# EAGLE design Pugsley (EAGLE 7.0.0)
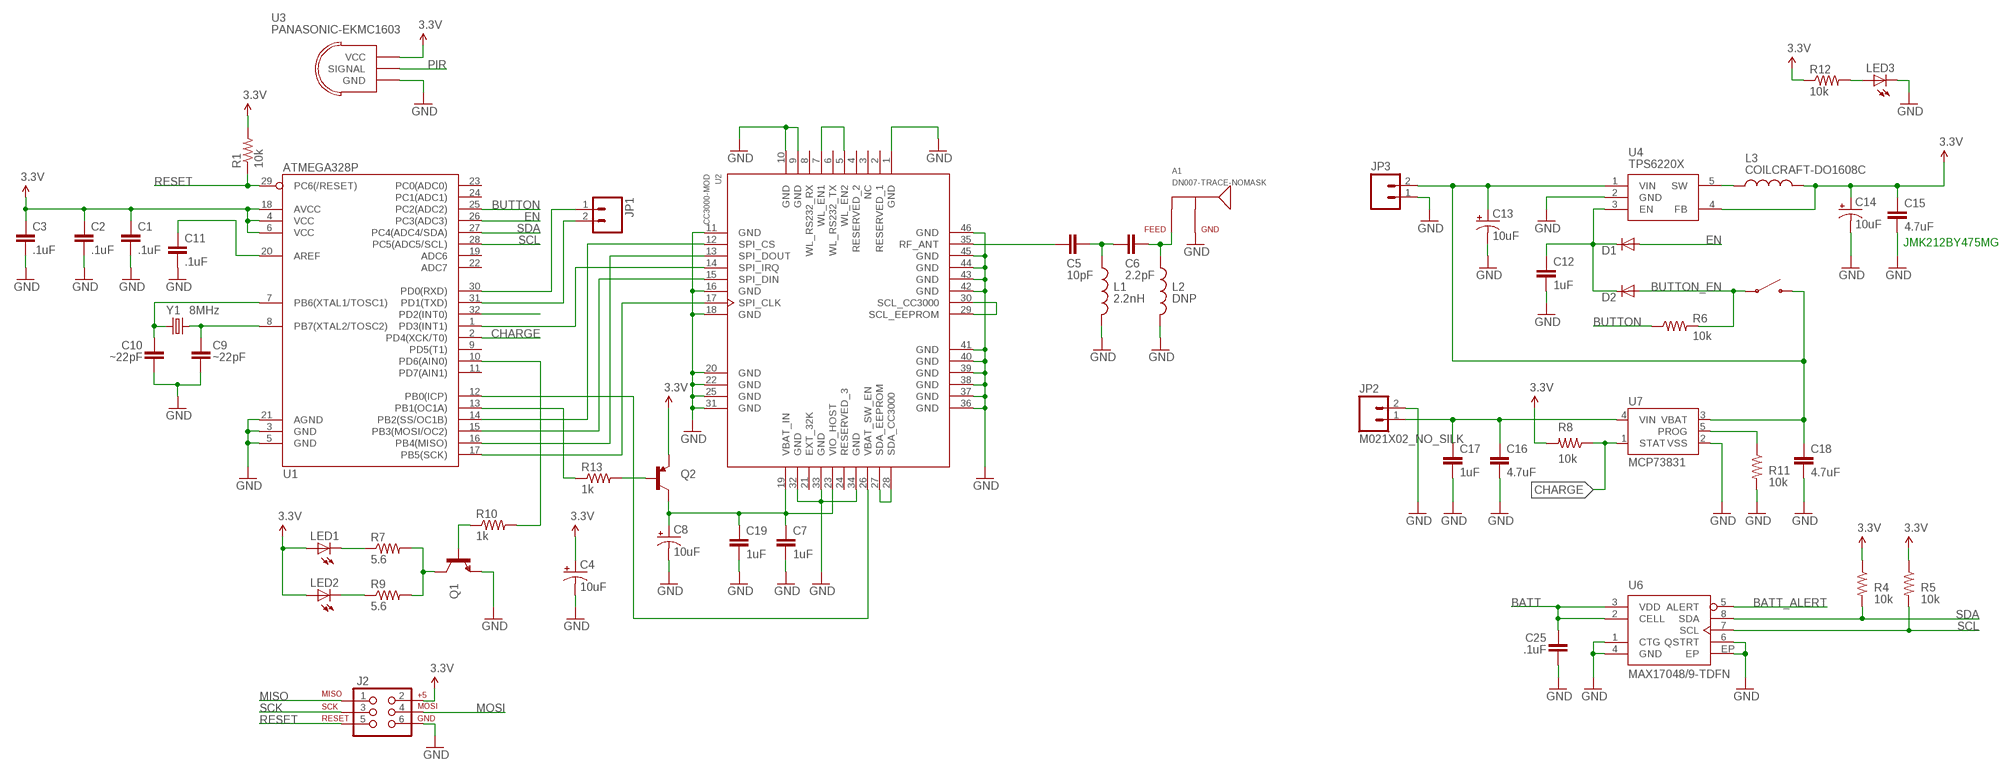
[diagram p0: schematic, sheet 1]

## Parts
A1  DN007-TRACE-NOMASK  [DN007-TRACE-NOMASK]
C1  .1uF  CAP0402-CAP  [0402-CAP]
C2  .1uF  CAP0402-CAP  [0402-CAP]
C3  .1uF  CAP0402-CAP  [0402-CAP]
C4  10uF  CAP_POL1206  [EIA3216]
C5  10pF  CAP0402-CAP  [0402-CAP]
C6  2.2pF  CAP0402-CAP  [0402-CAP]
C7  1uF  CAP0402-CAP  [0402-CAP]
C8  10uF  CAP_POL1206  [EIA3216]
C9  ~22pF  CAP0402-CAP  [0402-CAP]
C10  ~22pF  CAP0402-CAP  [0402-CAP]
C11  .1uF  CAP0402-CAP  [0402-CAP]
C12  1uF  CAP0402-CAP  [0402-CAP]
C13  10uF  CAP_POL1206  [EIA3216]
C14  10uF  CAP_POL1206  [EIA3216]
C15  4.7uF  CAP0805  [0805]
C16  4.7uF  CAP0805  [0805]
C17  1uF  CAP0402-CAP  [0402-CAP]
C18  4.7uF  CAP0805  [0805]
C19  1uF  CAP0402-CAP  [0402-CAP]
C25  .1uF  CAP0402-CAP  [0402-CAP]
D1  DIODESOD  [SOD-323]
D2  DIODESOD  [SOD-323]
J2  AVR_SPI_PRG_6NS  [2X3-NS]
JP1  M021X02_NO_SILK  [1X02_NO_SILK]
JP2  M021X02_NO_SILK  [1X02_NO_SILK]
JP3  M021X02_NO_SILK  [1X02_NO_SILK]
L1  2.2nH  INDUCTOR0402  [C0402]
L2  DNP  INDUCTOR0402  [C0402]
L3  COILCRAFT-DO1608C  [COILCRAFT-DO1608C]
LED1  LED0603  [LED-0603]
LED2  LED0603  [LED-0603]
LED3  LED0603  [LED-0603]
Q1  TRANSISTOR_NPNSOT23  [SOT23]
Q2  TRANSISTOR_PNPSMD  [SOT23-3]
R1  10k  RESISTOR0402-RES  [0402-RES]
R4  10k  RESISTOR0402-RES  [0402-RES]
R5  10k  RESISTOR0402-RES  [0402-RES]
R6  10k  RESISTOR0402-RES  [0402-RES]
R7  5.6  RESISTOR0402-RES  [0402-RES]
R8  10k  RESISTOR0402-RES  [0402-RES]
R9  5.6  RESISTOR0402-RES  [0402-RES]
R10  1k  RESISTOR0402-RES  [0402-RES]
R11  10k  RESISTOR0402-RES  [0402-RES]
R12  10k  RESISTOR0402-RES  [0402-RES]
R13  1k  RESISTOR0402-RES  [0402-RES]
S1  C&K-KSR2XX  [C&K-KSR2XX]
U1  ATMEGA328P  ATMEGA328_SMT  [TQFP32-08]
U2  CC3000-MOD  [CC3000]
U3  PANASONIC-EKMC1603  [PIR-PANASONIC-EKMC1603XXX]
U4  TPS6220X  [SOT23-5]
U6  MAX17048/9-TDFN  [TDFN-8]
U7  MCP73831  [SOT23-5]
Y1  8MHz  CRYSTAL5X3  [CRYSTAL-SMD-5X3]

## Nets
3.3V: C1.1 C2.1 C3.1 C4.A(+) C14.A(+) C15.1 J2.2 L3.2 LED1.A LED2.A Q2.2(E) R1.2 R4.1 R5.1 R8.2 R12.1 U1.4(VCC) U1.6(VCC) U1.18(AVCC) U3.VDD(VCC) U4.4(FB)
BATT: C13.A(+) C18.1 C25.1 JP3.2 S1.P$2 U4.1(VIN) U6.2(CELL) U6.3(VDD) U7.3(VBAT)
BATT_ALERT: U6.5(ALERT)
BUTTON: R6.1 U1.25(PC2(ADC2))
BUTTON_EN: D2.2(A) R6.2 S1.P$1
CHARGE: R8.1 U1.2(PD4(XCK/T0)) U7.1(STAT)
EN: D1.2(A) U1.26(PC3(ADC3))
GND: A1.GND@1(GND) A1.GND@2(GND) C1.2 C2.2 C3.2 C4.C(-) C7.2 C8.C(-) C9.2 C10.2 C11.2 C12.2 C13.C(-) C14.C(-) C15.2 C16.2 C17.2 C18.2 C19.2 C25.2 J2.6 JP2.2 JP3.1 L1.2 L2.2 LED3.C Q1.2(E) R11.2 U1.3(GND) U1.5(GND) U1.21(AGND) U2.1(GND) U2.9(GND) U2.10(GND) U2.11(GND) U2.16(GND) U2.18(GND) U2.20(GND) U2.22(GND) U2.25(GND) U2.31(GND) U2.32(GND) U2.33(GND) U2.34(GND) U2.36(GND) U2.37(GND) U2.38(GND) U2.39(GND) U2.40(GND) U2.41(GND) U2.42(GND) U2.43(GND) U2.44(GND) U2.45(GND) U2.46(GND) U3.GND U4.2(GND) U6.1(CTG) U6.4(GND) U6.6(QSTRT) U6.EP U7.2(VSS)
LED: R10.2 U1.10(PD6(AIN0))
MISO: J2.1 U1.16(PB4(MISO)) U2.13(SPI_DOUT)
MOSI: J2.4 U1.15(PB3(MOSI/OC2)) U2.15(SPI_DIN)
N$1: C11.1 U1.20(AREF)
N$2: C5.2 U2.35(RF_ANT)
N$3: Q1.1(B) R10.1
N$4: C12.1 D1.1(C) D2.1(C) U4.3(EN)
N$5: L3.1 U4.5(SW)
N$6: U1.1(PD3(INT1)) U2.14(SPI_IRQ)
N$7: R11.1 U7.5(PROG)
N$8: U2.29(SCL_EEPROM) U2.30(SCL_CC3000)
N$10: C5.1 C6.2 L1.1
N$11: A1.FEED C6.1 L2.1
N$13: U2.27(SDA_EEPROM) U2.28(SDA_CC3000)
N$15: LED1.C R7.1
N$16: C9.1 U1.8(PB7(XTAL2/TOSC2)) Y1.3
N$17: U2.5(WL_EN2) U2.7(WL_EN1)
N$20: C10.1 U1.7(PB6(XTAL1/TOSC1)) Y1.1
N$21: C7.1 C8.A(+) C19.1 Q2.3(C) U2.19(VBAT_IN) U2.23(VIO_HOST)
N$23: Q1.3(C) R7.2 R9.2
N$24: LED2.C R9.1
N$25: LED3.A R12.2
N$26: Q2.1(B) R13.2
PIR: U1.32(PD2(INT0)) U3.OUT(SIGNAL)
RESET: J2.5 R1.1 U1.29(PC6(/RESET))
RX: JP1.1 U1.30(PD0(RXD))
SCK: J2.3 U1.17(PB5(SCK)) U2.17(SPI_CLK)
SCL: R5.2 U1.28(PC5(ADC5/SCL)) U6.7(SCL)
SDA: R4.2 U1.27(PC4(ADC4/SDA)) U6.8(SDA)
TX: JP1.2 U1.31(PD1(TXD))
VIN: C16.1 C17.1 JP2.1 U7.4(VIN)
WIFI_CS: U1.14(PB2(SS/OC1B)) U2.12(SPI_CS)
WIFI_EN: U1.12(PB0(ICP)) U2.26(VBAT_SW_EN)
WIFI_PWR: R13.1 U1.13(PB1(OC1A))
Unconnected: U1.9(PD5(T1)) U1.11(PD7(AIN1)) U1.19(ADC6) U1.22(ADC7) U1.23(PC0(ADC0)) U1.24(PC1(ADC1)) U2.2(RESERVED_1) U2.3(NC) U2.4(RESERVED_2) U2.6(WL_RS232_TX) U2.8(WL_RS232_RX) U2.21(EXT_32K) U2.24(RESERVED_3)

## Notes on the sheet
- JMK212BY475MG

## Library data of the parts
A1 = Supernode-Antennas:DN007-TRACE
C1-C3 C5-C7 C9-C12 C15-C19 C25 = SparkFun-Capacitors:CAP: Capacitor Standard 0603 ceramic capacitor, and 0.1" leaded capacitor.
C4 C8 C13 C14 = SparkFun-Capacitors:CAP_POL: Capacitor Polarized These are standard SMD and PTH capacitors. Normally 10uF, 47uF, and 100uF in electrolytic and tantalum varieties. Always verify the external diameter of the through hole cap, it varies with capacity, voltage, and manufacturer. The EIA devices should be standard.
D1 D2 = SparkFun-DiscreteSemi:DIODE: Diode These are standard reverse protection diodes and small signal diodes. SMA package can handle up to about 1A. SOD-323 can handle about 200mA. What the SOD-323 package when ordering, there are some mfgs out there that are 5-pin packages.; PROD_ID: DIO-09646
J2 = SparkFun-Connectors:AVR_SPI_PRG_6: AVR ISP 6 Pin This is the reduced ISP connector for AVR programming. Common on Arduino. This footprint will take up less PCB space and can be used with a 10-pin to 6-pin adapter such as SKU: BOB-08508
JP1-JP3 = SparkFun-Connectors:M02: Standard 2-pin 0.1" header. Use with - straight break away headers ( PRT-00116) - right angle break away headers (PRT-00553) - swiss pins (PRT-00743) - machine pins (PRT-00117) - female headers (PRT-00115) Molex polarized connector foot print use with: PRT-08233 with associated crimp pins and housings. 2.54_SCREWTERM for use with PRT-10571. 3.5mm Screw Terminal footprints for PRT-08084 5mm Screw Terminal footprints for use with PRT-08433
L1 L2 = SparkFun-Passives:INDUCTOR: Inductors Basic Inductor/Choke - 0603 and 1206. Footprints are not proven and vary greatly between part numbers. SRN6045- 33uH, 20% 1.4A SDR0403-560KL - 56uH, 10%, 500mA RMS/740mA peak
L3 = Supernode-Inductors:COILCRAFT-DO1608C
LED1-LED3 = SparkFun-LED:LED: LEDs Standard schematic elements and footprints for 5mm, 3mm, 1206, and 0603 sized LEDs. 5mm - Spark Fun Electronics SKU : COM-00529 (and others)
Q1 = SparkFun-DiscreteSemi:TRANSISTOR_NPN: Generic NPN BJT MMBT2222A - TRANS-08049 (SOT-23, 1A 40V) MPSA42 - TRANS-09116 (SOT-23, 500mA 300V) MMBT5088LT1G - TRANS-11160 (SOT-23, 50 mA 30V)
Q2 = SparkFun-DiscreteSemi:TRANSISTOR_PNP: Generic PNP BJT Double check pinouts against datasheets- not all devices are the same! MMBT3906 - 40V 200mA SOT-23 (TRANS-08052) MMBT4403 - 40V 600mA SOT-23 (TRANS-09245)
R1 R4-R13 = SparkFun-Passives:RESISTOR: Resistor Basic schematic elements and footprints for 0603, 1206, and PTH resistors.
S1 = Supernode-Electromechanical:C&K-KSR2XX
U1 = SparkFun-DigitalIC:ATMEGA328_SMT: 32-Pin Atmega328 part Commonly used on Arduino compatible boards Available in QFP and QFN packages TQFP is IC-09069 QFN is non-stock; PROD_ID: IC-09069
U2 = Supernode-RF:CC3000-MOD
U3 = Supernode-Sensors:PANASONIC-EKMC16
U4 = Supernode-PowerIC:TPS6220X: Texas Instruments TPS6220X Adjustable, 300-mA, 95% Efficient Step-Down Converter in SOT-23 Description The TPS6220x devices are a family of high-efficiency synchronous step-down converters ideally suited for portable systems powered by 1-cell Li-Ion or 3-cell NiMH/NiCd batteries. The devices are also suitable to operate from a standard 3.3-V or 5-V voltage rail. With an output voltage range of 6 V down to 0.7 V and up to 300 mA output current, the devices are ideal to power low voltage DSPs and processors used in PDAs, pocket PCs, and smart phones. Under nominal load current, the devices operate with a fixed switching frequency of typically 1 MHz. At light load currents, the part enters the power save mode operation; the switching frequency is reduced and the quiescent current is typically only 15 µA; therefore, it achieves the highest efficiency over the entire load current range. The TPS6220x needs only three small external components. Together with the SOT23 package, a minimum system solution size is achieved. An advanced fast response voltage mode control scheme achieves superior line and load regulation with small ceramic input and output capacitors. Features High Efficiency Synchronous Step-Down Converter With up to 95% Efficiency 2.5-V to 6-V Input Voltage Range Adjustable Output Voltage Range From 0.7 V to VI Fixed Output Voltage Options Available Up to 300 mA Output Current 1-MHz Fixed Frequency PWM Operation Highest Efficiency Over Wide Load Current Range Due to Power Save Mode 15-µA Typical Quiescent Current Soft Start 100% Duty Cycle Low-Dropout Operation Dynamic Output-Voltage Positioning Available in a 5-Pin SOT23 Package APPLICATIONS PDAs and Pocket PC Cellular Phones, Smart Phones Low Power DSP Supply Digital Cameras Portable Media Players Portable Equipment
U6 = Supernode-PowerIC:MAX17048/9
U7 = SparkFun-PowerIC:MCP73831: Miniature single cell, fully integrated Li-Ion, Li-polymer charge management controller http://ww1.microchip.com/downloads/en/DeviceDoc/21984a.pdf IC-09995; PROD_ID: IC-09995
Y1 = SparkFun-FreqCtrl:CRYSTAL: Various standard crystals. Proven footprints. Spark Fun Electronics SKU : COM-00534

## Board
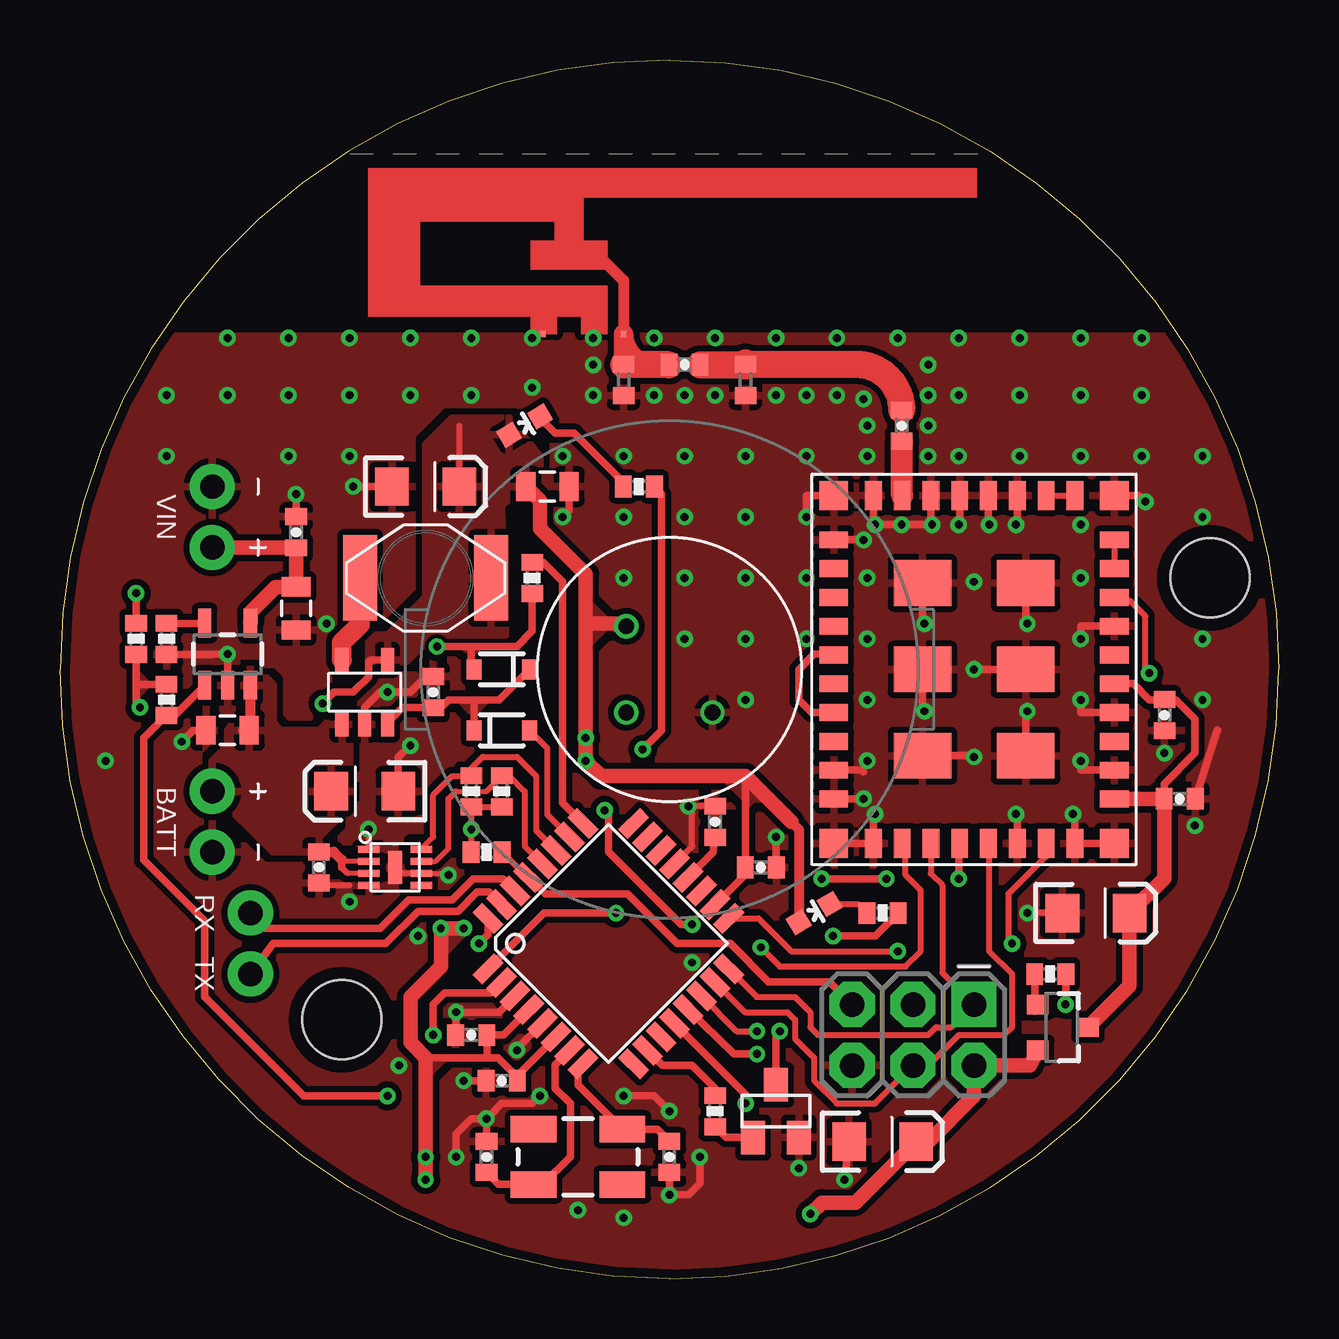
[diagram p1: board, top side]
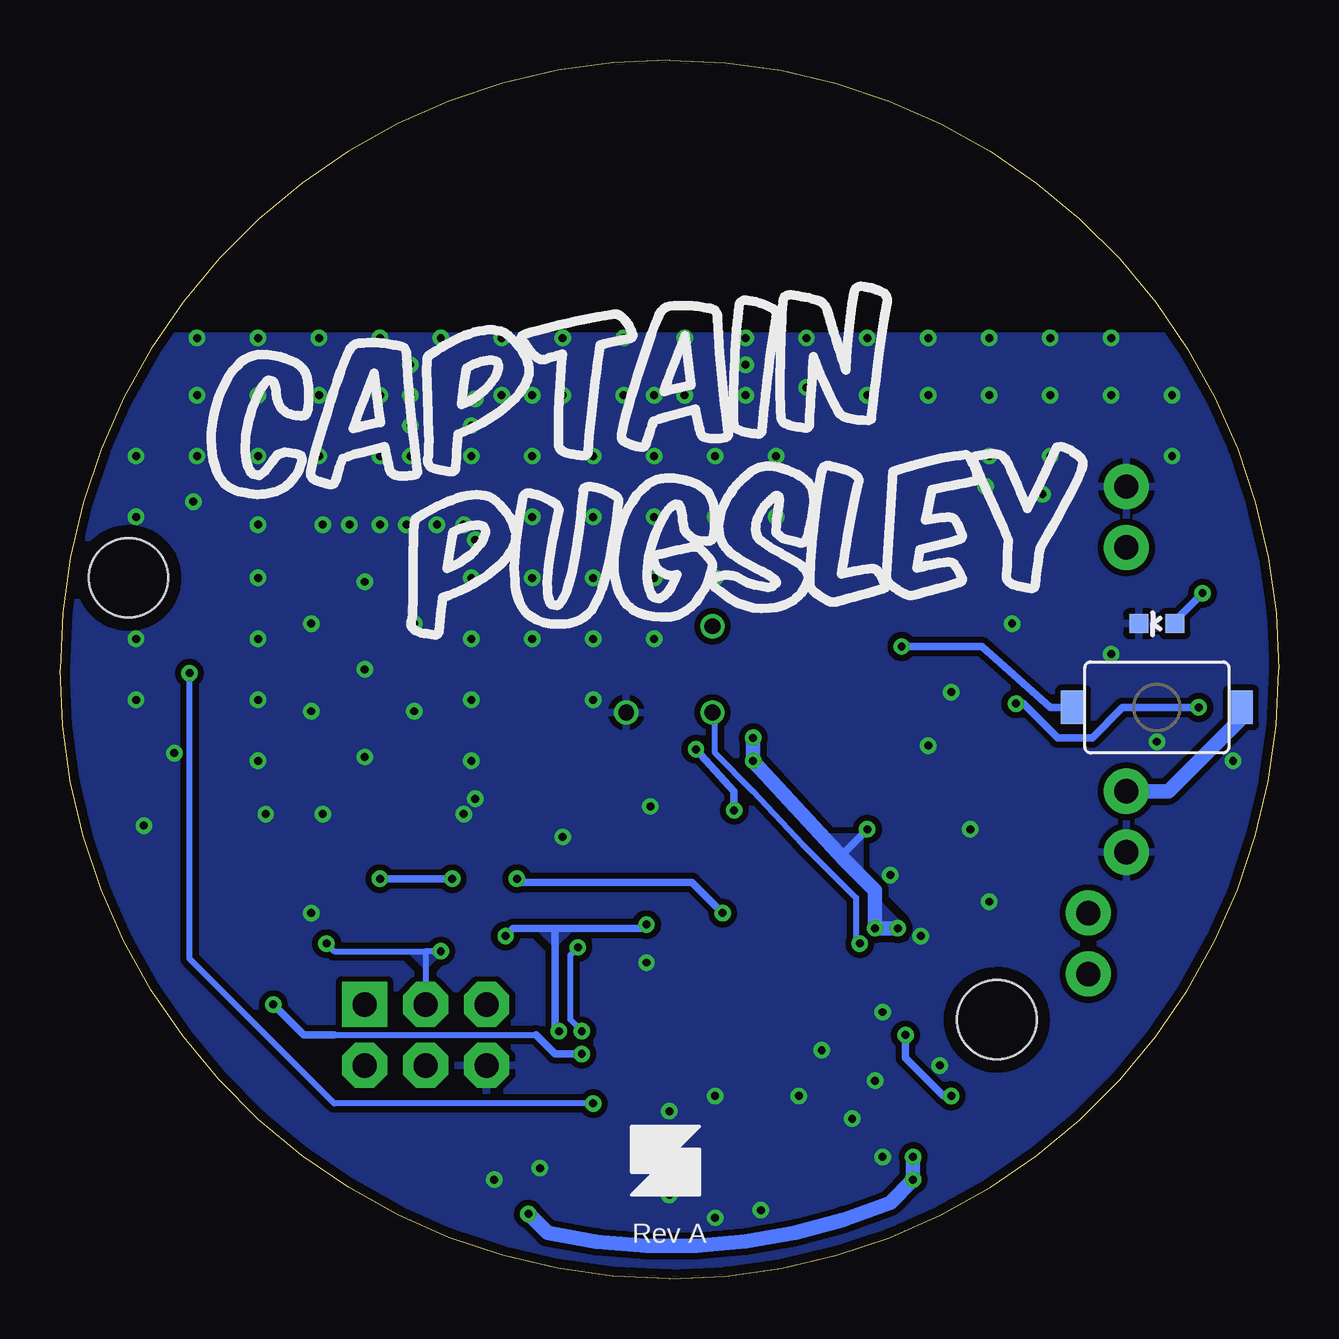
[diagram p2: board, bottom side, seen from below]

Size 50.8 x 50.8 mm. Coordinates in mm from the lower left corner, seen from the top.
Outline: 25.4,0 arc-90 0,25.4 arc-90 25.4,50.8 arc-90 50.8,25.4 arc-90 25.4,0
Copper layers (1*16): Top 0.0356mm / dielectric 1.5011mm / Bottom 0.0356mm
Design rules "OSHPark *": minimum track width 6mil, minimum drill 13mil, track to track 6mil, track to pad 6mil, pad to pad 6mil, via to via 6mil, smd to smd 6mil, copper to edge 15mil, drill to drill 6mil, minimum pad ring 7mil, minimum via ring 7mil, stop-mask expansion 4mil, vias tented up to drill 13mil, thermal gap 10mil
tRestrict: 2 lines

### Footprints (pad centres in the part's own frame; a part is rotated, then mirrored left to right if it is on the bottom)
DN007-TRACE-NOMASK = smd 0.25 x 0.25: FEED 0,0; GND@1 -3.38,0; GND@2 -1.27,0
0402-CAP = smd 0.7 x 0.9: 1 -0.65,0; 2 0.65,0
EIA3216 = smd 1.4 x 1.6: A 1.4,0; C -1.4,0
0805 = smd 0.8 x 1.2: 1 -0.9,0; 2 0.9,0
SOD-323 = smd 0.63 x 0.83: 1 -1.15,0; 2 1.15,0
2X3-NS = drill 1.016 pad 1.88 square: 1 -2.54,-1.27 | drill 1.016 pad 1.88 octagon: 2 -2.54,1.27; 3 0,-1.27; 4 0,1.27; 5 2.54,-1.27; 6 2.54,1.27
1X02_NO_SILK = drill 1.016 pad 1.88: 1 0,0; 2 2.54,0
C0402 = smd 0.7 x 0.9: 1 -0.65,0; 2 0.65,0
COILCRAFT-DO1608C = smd 1.4 x 3.56: 1 -2.73,0; 2 2.73,0
LED-0603 = smd 0.8 x 0.8: A 0,-0.75; C 0,0.75
SOT23 = smd 1 x 1.4: 1 -0.95,-1.1; 2 0.95,-1.1; 3 0,1.1
SOT23-3 = smd 0.8 x 0.9: 1 -0.95,-1; 2 0.95,-1; 3 0,1.1
0402-RES = smd 0.7 x 0.9: 1 -0.65,0; 2 0.65,0
C&K-KSR2XX = smd 1 x 1.4: P$1 -3.5,0; P$2 3.5,0
TQFP32-08 = smd 1.27 x 0.559: 1 -4.293,2.8; 2 -4.293,2; 3 -4.293,1.2; 4 -4.293,0.4; 5 -4.293,-0.4; 6 -4.293,-1.2; 7 -4.293,-2; 8 -4.293,-2.8; 17 4.293,-2.8; 18 4.293,-2; 19 4.293,-1.2; 20 4.293,-0.4; 21 4.293,0.4; 22 4.293,1.2; 23 4.293,2; 24 4.293,2.8 | smd 0.559 x 1.27: 9 -2.8,-4.293; 10 -2,-4.293; 11 -1.2,-4.293; 12 -0.4,-4.293; 13 0.4,-4.293; 14 1.2,-4.293; 15 2,-4.293; 16 2.8,-4.293; 25 2.8,4.293; 26 2,4.293; 27 1.2,4.293; 28 0.4,4.293; 29 -0.4,4.293; 30 -1.2,4.293; 31 -2,4.293; 32 -2.8,4.293
CC3000 = smd 1.2 x 0.7: 1 -5.85,5.4; 2 -5.85,4.2; 3 -5.85,3; 4 -5.85,1.8; 5 -5.85,0.6; 6 -5.85,-0.6; 7 -5.85,-1.8; 8 -5.85,-3; 9 -5.85,-4.2; 10 -5.85,-5.4; 19 5.85,-5.4; 20 5.85,-4.2; 21 5.85,-3; 22 5.85,-1.8; 23 5.85,-0.6; 24 5.85,0.6; 25 5.85,1.8; 26 5.85,3; 27 5.85,4.2; 28 5.85,5.4 | smd 0.7 x 1.2: 11 -4.2,-7.25; 12 -3,-7.25; 13 -1.8,-7.25; 14 -0.6,-7.25; 15 0.6,-7.25; 16 1.8,-7.25; 17 3,-7.25; 18 4.2,-7.25; 29 4.2,7.25; 30 3,7.25; 31 1.8,7.25; 32 0.6,7.25; 33 -0.6,7.25; 34 -1.8,7.25; 35 -3,7.25; 36 -4.2,7.25 | smd 2.4 x 1.9: 37 -2.15,3.6; 38 -2.15,0; 39 -2.15,-3.6; 40 2.15,3.6; 41 2.15,0; 42 2.15,-3.6 | smd 1.2 x 1.2: 43 -5.85,7.25; 44 -5.85,-7.25; 45 5.85,-7.25; 46 5.85,7.25
PIR-PANASONIC-EKMC1603XXX = drill 0.65: GND -1.796,1.796; OUT 1.796,1.796; VDD 1.796,-1.796
SOT23-5 = smd 0.55 x 1: 1 -0.95,-1.35; 2 0,-1.35; 3 0.95,-1.35; 4 0.95,1.35; 5 -0.95,1.35
TDFN-8 = smd 0.9 x 0.3: 1 -1.09,0.75; 2 -1.09,0.25; 3 -1.09,-0.25; 4 -1.09,-0.75; 5 1.09,-0.75; 6 1.09,-0.25; 7 1.09,0.25; 8 1.09,0.75 | smd 0.6 x 1.38: EP 0,0
SOT23-5' = smd 0.55 x 1.2: 1 -0.95,-1.3; 2 0,-1.3; 3 0.95,-1.3; 4 0.95,1.3; 5 -0.95,1.3
STAND-OFF = hole 3.302: 0,0
CRYSTAL-SMD-5X3 = smd 1.9 x 1.1: 1 -1.85,-1.15; 2 1.85,-1.15; 3 1.85,1.15; 4 -1.85,1.15

### Placement (x,y rotation side)
A1  23.5,39.37 0 top
C1  17.14,10.16 180 top
C2  29.21,17.14 0 top
C3  18.41,8.26 180 top
C4  34.29,5.71 0 top
C5  35.08,35.56 270 top
C6  26.04,38.1 0 top
C7  46.67,20 0 top
C8  43.18,15.24 0 top
C9  25.4,5.08 270 top
C10  17.78,5.08 90 top
C11  27.3,19.05 90 top
C12  15.56,24.45 90 top
C13  12.7,20.32 180 top
C14  15.24,33.02 0 top
C15  20.32,33.02 0 top
C16  9.84,27.94 270 top
C17  9.84,31.11 90 top
C18  6.99,22.86 180 top
C19  46.04,23.5 270 top
C25  10.79,17.14 270 top
D1  18.41,22.86 0 top
D2  18.41,25.4 180 top
J2  35.56,10.16 180 top
JP1  7.94,15.24 270 top
JP2  6.35,30.48 90 top
JP3  6.35,17.78 90 bottom
L1  28.57,37.47 270 top
L2  23.5,37.47 270 top
L3  15.24,29.21 0 top
LED1  19.37,35.56 300.7 top
LED2  31.43,15.24 300.7 top
LED3  5.08,27.3 90 bottom
Q1  29.84,6.99 0 top
Q2  41.75,10.48 270 top
R1  17.78,17.78 180 top
R4  17.14,20.32 90 top
R5  18.41,20.32 90 top
R6  19.68,29.21 270 top
R7  24.13,33.02 0 top
R8  4.45,24.13 90 top
R9  34.29,15.24 0 top
R10  27.3,6.99 90 top
R11  4.45,26.67 270 top
R12  3.17,26.67 90 top
R13  41.27,12.7 180 top
S1  5.08,23.81 0 bottom
U1  22.86,13.97 45 top
U2  38.1,25.4 0 top
U3  25.4,25.4 180 top
U4  12.7,24.45 0 top
U6  13.97,17.14 0 top
U7  MCP73831  [SOT23-5']  6.99,26.04 0 top
U$1  [STAND-OFF]  11.75,10.79 0 top
U$2  [STAND-OFF]  47.94,29.21 0 top
Y1  21.59,5.08 0 top

### Tracks (layer width: path | path; a pad name or v marks a point on that pad's centre or on a via)
3.3V  (via drill 0.33)
  Top 0.254: R5.1 R4.1 v17.14,18.73 17.14,17.8 R1.2 | 16.64,35.56 C14.A
  Top 0.305: U1.4 18.48,10.16 C1.1 17.8,9.22 17.78,9.21 | U1.6 19.07,8.48 | 19.07,8.48 C3.1 | 17.78,9.21 18.26,9.21 18.91,8.56 19.07,8.48 | 17.78,9.21 15.24,9.21 | U1.18 28.56,16.84 C2.1 28.73,17.32 28.57,17.32 28.57,20.95 | v3.33,23.81 3.17,23.97 3.17,24.77 | 3.17,24.77 R12.1 | R8.2 4.43,24.77 3.17,24.77 | U4.4 12.94,25.8 12.86,25.72 12.86,25.08 12.22,24.45 11.43,24.45 v10.95,23.97
  Top 0.406: LED2.A 30.8,18.73 30.48,19.05
  Top 0.61: v16.83,14.61 v15.88,14.61 15.88,13.02 14.61,11.75 14.61,9.84 15.24,9.21 v15.24,5.08 v15.24,4.13 | 19.68,32.76 C15.1 20,32.44 20,31.27 21.91,29.37 21.91,27.3 | v31.27,2.7 31.75,3.17 33.15,3.17 C4.A 36.2,5.71 38.1,7.62 J2.2 40.43,8.89 Q2.2 | 30.48,19.05 28.57,20.95 22.54,20.95 v21.91,21.59 v21.91,22.54 21.91,27.3 | 21.91,27.3 23.18,27.3 23.29,27.2 U3.VDD
  Bottom 0.254: 18.34,17.54 18.18,17.54 18.1,17.46
  Bottom 0.305: v3.33,23.81 6.51,23.81 7.78,22.54 9.21,22.54 10.64,23.97 v10.95,23.97 | v17.14,18.73 18.34,17.54
  Bottom 0.61: v21.91,22.54 v21.91,21.59 18.1,17.46 16.83,16.19 v16.83,14.61 v15.88,14.61 | v31.27,2.7 30.48,1.91 arc-35 16.19,3.17 v15.24,4.13 v15.24,5.08
  pour Top: 14.45,25.72 15.56,26.83 18.57,26.83 18.41,32.23 20,33.66 20,34.29 18.73,35.88 16.35,35.88 15.24,34.77 15.24,28.42 13.65,26.83 13.18,26.83 12.86,26.51 12.86,25.72
  pour Top: 16.03,9.21 15.24,9.21 15.24,8.41
  pour Bottom: 17.46,18.41 17.46,16.83 19.05,18.41
  pour Top: 3.65,24.77 3.17,24.29 3.17,25.24
  pour Bottom: 15.88,14.61 16.83,14.61 16.83,15.56
  pour Top: 15.88,14.61 16.83,14.61 15.88,13.65
  pour Top: 27.62,20.95 28.57,20 28.57,19.68 28.89,20 29.53,20 28.57,20.95
  pour Top: 22.7,27.3 21.91,28.1 21.91,26.51
BATT
  Top 0.203: U6.3 12,16.89 | U6.2 11.81,17.39
  Top 0.254: 12,16.89 11.75,17.14 | 11.81,17.39 11.75,17.46
  Top 0.305: 11.75,17.14 11.75,17.46
  Top 0.406: C25.1 11.41,17.8 11.75,17.46 | U7.3 7.93,23.18 7.62,22.86
  Bottom 0.61: JP3.2 4.6,20.32 1.59,23.34 S1.P$2
  pour Top (isolate 0.254): 6.35,21.59 6.99,22.23 6.99,22.86 7.46,23.5 7.46,25.4 8.26,25.4 8.89,24.77 8.89,23.18 9.21,22.86 10.79,22.86 11.43,23.5 11.75,23.5 12.06,23.18 12.06,19.68 10.79,18.41 10.79,17.78 8.89,17.78 6.35,20.32
BUTTON
  Top 0.305: U1.25 20.95,19.84 20.95,29.05 20.15,29.86 R6.1
BUTTON_EN  (via drill 0.33)
  Top 0.305: 17.14,25.52 D2.2 17.14,25.4 17.14,26.35 | v15.72,26.35 17.14,26.35 | 17.14,26.35 19.05,26.35 19.68,26.99 R6.2
  Bottom 0.305: S1.P$1 9.53,23.81 12.38,26.35 v15.72,26.35
  pour Top: 17.14,26.04 16.83,26.35 17.46,26.35
CHARGE  (via drill 0.33)
  Top 0.305: U1.2 17.97,11.91 16.03,11.91 15.56,11.43 v15.56,10.16 | v13.65,7.62 10.16,7.62 6.03,11.75 6.03,14.92 3.49,17.46 3.49,22.54 4.45,23.5 R8.1 4.78,23.48 U7.1
  Bottom 0.305: v15.56,10.16 15.56,9.21 13.97,7.62 v13.65,7.62
EN
  Top 0.254: U1.26 20.32,19.34 20.32,22.11 D1.2
GND  (via drill 0.33)
  Top 0.203: U6.6 16.12,16.89
  Top 0.254: C8.C v40.32,15.24 | 12.06,16.39 10.89,16.39 C25.2 | 16.12,16.89 v16.19,16.83 | U6.6 14.22,16.89 U6.EP | U6.1 12.88,18.55 v12.86,18.73 | C11.2 26.68,19.7 v26.19,19.68 26.35,19.37 26.35,18.03 U1.21
  Top 0.305: C17.2 v9.84,32.7 | U7.2 v6.99,26.04 6.33,26.02 R11.2 | U4.2 12.7,23.81 13.34,24.45 v13.65,24.45 14.61,24.45 15.26,25.1 C12.2 | C7.2 48.24,22.88 48.26,22.86 | C2.2 29.84,17.14 v29.84,18.41 | C13.C 14.1,21.72 v14.61,22.23 | C14.C v12.22,33.02 | C15.2 21.22,32.02 v20.95,31.75 | C11.2 27,19.7 | U2.9 33.41,21.2 33.5,21.11 | U2.10 v33.49,20 v33.5,20 | v33.97,19.37 33.9,19.3 U2.11 U2.44 | U2.16 39.9,19.31 v39.85,19.37 | v42.23,19.37 42.3,19.3 U2.18 U2.45 | U2.39 38.05,21.8 v38.1,21.75 | U2.42 40.25,23.58 v40.32,23.65 | U2.41 v38.1,25.4 | U2.38 35.95,23.74 v36.04,23.65 | U2.37 35.95,27.39 v36.04,27.3 | U2.40 40.25,27.38 v40.32,27.3 | U2.31 39.9,31.49 v39.85,31.43 | U2.32 38.7,31.47 v38.73,31.43 | U2.33 37.5,31.47 v37.47,31.43 | U2.34 36.3,31.49 v36.35,31.43 v35.08,31.43 v33.97,31.43 33.9,31.5 U2.36 | U2.1 v33.49,30.8 v33.5,30.8 | 32.02,32.65 U2.43 31.11,32.65 v31.11,31.75 | U2.46 44.98,32.65 v45.24,32.38 | U1.5 19.05,9.59 v19.05,9.53 | U1.3 18.3,11.11 v16.51,11.11 | 16.67,11.27 v16.51,11.11 | C3.2 v16.83,8.26 | C10.2 v17.78,6.67 17.14,6.67 16.51,6.03 v16.51,5.08 | C9.2 v25.4,3.49 26.19,3.49 26.67,3.97 v26.67,5.08 | v23.5,7.62 24.77,7.62 v25.4,6.99 | v20,7.62 19.68,7.3 18.41,7.3 17.94,6.83 | C18.2 5.56,22.86 v5.08,22.38 | v16.51,11.11 16.51,10.48 | U2.20 42.55,21.2 v42.55,21.59 | U2.22 42.55,23.6 v42.55,24.13 | U2.25 42.55,27.2 v42.55,26.67 | C4.C v32.7,4.13
  other vias: 12.06,15.72 11.11,27.3 33.66,34.29 33.66,35.56 32.38,36.83 29.84,36.83 27.3,36.83 24.77,36.83 22.23,36.83 19.68,37.15 17.14,36.83 14.61,36.83 33.5,36.67 37.47,36.83 40.01,36.83 42.55,36.83 37.47,34.29 40.01,34.29 31.11,34.29 28.57,34.29 26.04,34.29 23.5,34.29 20.95,34.29 28.57,31.75 26.04,31.75 23.5,31.75 23.5,29.21 26.04,29.21 28.57,29.21 28.57,26.67 26.04,26.67 24.77,39.21 27.3,39.21 29.84,39.21 32.38,39.21 34.92,39.21 37.47,39.21 40.01,39.21 42.55,39.21 36.2,34.29 22.23,38.1 17.14,39.21 14.61,39.21 12.06,39.21 9.53,39.21 38.1,29.05 31.11,29.21 31.11,26.67 23.5,2.54 21.59,2.86 22.23,39.21 19.68,39.21 12.06,36.83 9.53,36.83 6.99,36.83 45.09,36.83 45.09,34.29 31.11,36.83 36.2,35.56 36.2,36.83 36.2,38.1 26.04,36.83 9.53,34.29 12.06,34.29 33.66,26.67 33.66,29.21 33.66,24.13 33.66,21.59 42.55,29.21 45.09,39.21 47.62,34.29 6.99,39.21 4.45,36.83 4.45,34.29 1.91,21.59 14.92,14.29 47.62,31.75 47.31,18.89 26.35,13.18 30.8,4.6 46.04,21.91 42.55,34.29 42.55,31.43 28.57,24.13 47.62,26.67 47.62,24.13 14.13,8.89
  pour Bottom (isolate 0.254, rank 3): 0,0 0,39.29 50.8,39.29 50.8,0
  pour Top (isolate 0.254, rank 3): 0,0 0,39.29 50.8,39.29 50.8,0
LED
  Top 0.305: R10.2 27.3,7.94 26.35,8.89 25.11,8.89 U1.10
MISO
  Top 0.254: U1.16 29.04,11.75 30.64,11.75 31.27,11.11 31.27,10.48 31.59,10.16 36.2,10.16 36.51,10.48 37.15,10.48 J2.1 36.78,12.75 36.78,16.41 36.3,16.88 U2.13
MOSI
  Top 0.254: U1.15 28.55,11.11 30.32,11.11 30.64,10.79 30.64,10 31.43,9.21 31.43,8.26 32.38,7.3 33.97,7.3 J2.4 36.2,8.89 37.47,10.16 39.37,10.16 39.69,10.48 39.69,12.7 38.73,13.65 38.73,18.11 U2.15
N$1
  Top 0.305: U1.20 27.22,17.77 C11.1
N$2
  Top 0.61: 35.1,34.89 C5.2
  Top 0.914: U2.35 35.1,34.89
N$3
  Top 0.305: Q1.1 27.75,5.88 R10.1
N$4
  Top 0.305: U4.3 13.65,23.18 14.29,23.81 15.54,23.81 C12.1 15.86,23.8 16.19,24.13 17.14,24.13 | 17.14,24.13 18.3,24.13 D2.1 | D1.1 17.27,24.01 17.14,24.13
  pour Top: 16.83,24.13 17.78,24.13 17.3,23.65 17.14,23.65 16.67,24.13
N$5
  Top 0.813: L3.1 12.51,27.27 11.75,26.51 U4.5
N$6  (via drill 0.33)
  Top 0.305: v31.75,16.67 v34.45,16.67 | v37.47,16.67 37.47,18.11 U2.14 | U1.1 20.17,15.24 v23.18,15.24
  Bottom 0.305: v23.18,15.24 24.45,16.51 31.59,16.51 v31.75,16.67 | v34.45,16.67 v37.47,16.67
N$7
  Top 0.305: R11.1 6.02,27.32 U7.5
N$8
  Top 0.254: U2.30 U2.29
N$10
  Top 1.118: L1.1 33.18,38.12 arc-90 C5.1 | C6.2 28.56,38.1
  Top 1.219: 28.56,38.1 arc90 L1.1
N$11
  Top 0.813: C6.1 24.77,38.1 arc-90 A1.FEED 23.5,37.94
  Top 1.118: C6.1 23.51,38.1 arc-90 L2.1
N$13
  Top 0.254: U2.28 U2.27
N$15
  Top 0.305: LED1.C 19.94,35.94 20.64,35.24 21.43,35.24 23.65,33.02 R7.1
N$16
  Top 0.305: U1.8 21.8,8.79 21.59,8.57 21.59,8.08 Y1.3 24.9,6.23 C9.1
N$17
  Top 0.305: U2.7 31.33,23.6 30.8,24.13 30.8,25.4 31.43,26.04 32.22,26.04 U2.5
N$20
  Top 0.305: U1.7 20.64,8.92 20.64,7.94 21.27,7.3 21.27,5.08 20.12,3.93 Y1.1 18.28,3.93 C10.1
N$21
  Top 0.305: C7.1 46.02,20.62 47.31,21.91 47.31,23.34 46.51,24.13 46.05,24.13 C19.1 46.02,24.13 45.4,24.13 44.73,24.8 U2.23
  Top 0.61: U2.19 C7.1 46.02,16.68 C8.A 44.58,12.21 Q2.3
N$23  (via drill 0.33)
  Top 0.305: R9.2 33.99,14.29 v32.23,14.29 | v22.7,19.53 22.86,19.37 22.86,17.78 25.88,14.76 v26.35,14.76 | R7.2 25.08,32.7 25.08,22.86 v24.29,22.07 | Q1.3 29.84,10.16 v30,10.32
  Bottom 0.305: v32.23,14.29 31.91,14.61 30.16,14.61 | 30.16,14.61 30.16,10.48 v30,10.32 | v24.29,22.07 22.7,20.32 v22.7,19.53 | v26.35,14.76 26.51,14.61 30.16,14.61
  pour Bottom: 30.8,14.61 30.16,13.97 29.53,14.61
N$24
  Top 0.254: LED2.C 33.26,15.62 R9.1
N$25  (via drill 0.33)
  Top 0.305: v3.17,28.57 R12.2
  Bottom 0.305: LED3.A 4.33,27.42 v3.17,28.57
N$26
  Top 0.305: R13.2 40.62,11.14 Q2.1
PIR  (via drill 0.33)
  Top 0.305: 18.11,14.76 18.1,14.61 18.1,14.77 U1.32 17.84,14.35 v17.46,13.97
  Bottom 0.254: v17.46,13.97 17.62,14.13 17.62,15.88 19.84,18.1 21.91,20.32 23.5,21.91 23.5,23.5 23.65,23.55 U3.OUT
RESET
  Top 0.254: U1.29 19.49,16.72 R1.1
  Top 0.305: U1.29 20.23,16.03 23.65,16.03 25.72,13.97 27.94,13.97 29.53,12.38 32.07,12.38 J2.5
  Bottom 0.254: J2.5 32.7,11.43
RX
  Top 0.305: U1.30 18.46,16.67 17.22,16.67 16.35,15.8 14.53,15.8 13.34,14.61 8.57,14.61 JP1.1
SCK  (via drill 0.33)
  Top 0.254: U2.17 41.1,17.61 39.53,16.03 39.53,14.13 v39.69,13.97 | U1.17 29.11,15.03 30.48,13.65 v34.92,13.65
  Bottom 0.254: v39.69,13.97 39.37,13.65 35.56,13.65 | 35.56,13.65 J2.3 | v34.92,13.65 35.56,13.65
  pour Bottom: 34.92,13.65 35.56,13.02 36.2,13.65
SCL
  Top 0.203: U6.7 15.65,17.39 16.19,17.94 | 16.51,20.32 17.77,20.32
  Top 0.254: 16.19,17.94 16.19,20 16.51,20.32 | 17.77,20.32 R5.2 18.72,20.97 19.37,20.32 19.37,18.03 U1.28
SDA
  Top 0.203: 15.06,17.92 15.56,18.41
  Top 0.254: U6.8 15.06,17.92 | 15.56,18.41 15.56,20.16 16.35,20.95 17.13,20.95 R4.2 17.14,21.27 17.62,21.75 19.05,21.75 19.84,20.95 19.84,18.68 U1.27
TX
  Top 0.305: U1.31 17.89,16.11 17.38,16.11 16.59,15.32 14.92,15.32 13.57,13.97 8.89,13.97 JP1.2
VIN
  Top 0.61: U7.4 7.94,27.78 9,28.84 C16.1 C17.1 9.83,30.48 JP2.1
WIFI_CS  (via drill 0.33)
  Top 0.254: U1.14 28.21,10.32 v29.05,10.32 | v29.21,13.81 30,13.02 35.24,13.02 35.88,13.65 35.88,16.19 35.24,16.83 35.24,18.01 U2.12
  Bottom 0.254: v29.05,10.32 29.53,10.79 29.53,13.49 v29.21,13.81
WIFI_EN  (via drill 0.33)
  Top 0.254: U1.12 25.61,10.58 | v45.4,25.24 45.24,25.4 45.24,27.62 44.61,28.26 44.09,28.26 U2.26
  Top 0.305: v28.57,7.3 28.57,7.69 U1.12
  Bottom 0.254: v28.57,7.3 39.37,7.3 45.4,13.34 v45.4,25.24
WIFI_PWR  (via drill 0.33)
  Top 0.305: R13.1 41.92,11.45 v41.91,11.43 | v29.05,9.37 28.1,9.37 U1.13
  Bottom 0.254: 39.37,10.16 30.96,10.16
  Bottom 0.305: v41.91,11.43 40.64,10.16 39.37,10.16 | 30.96,10.16 30.16,9.37 v29.05,9.37

### Text on the board
tPlace: VIN | BATT | RX | TX
bPlace: Rev A